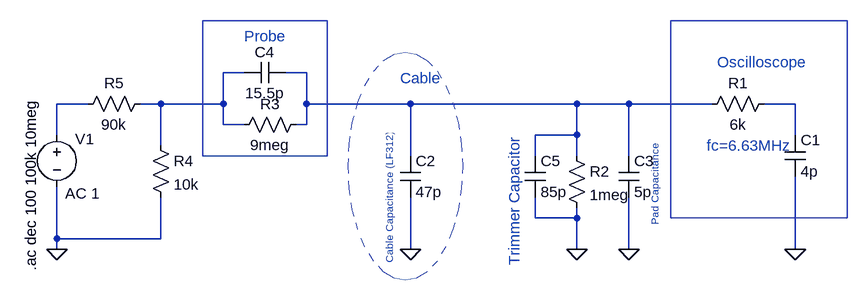
[diagram p0: schematic ADC_passiveInput_10-1.asc]
ADC_passiveInput_10-1.asc, the LTspice schematic file:
Version 4
SHEET 1 880 680
WIRE -320 32 -352 32
WIRE -224 32 -256 32
WIRE -560 80 -608 80
WIRE -448 80 -480 80
WIRE -352 80 -352 32
WIRE -352 80 -448 80
WIRE -224 80 -224 32
WIRE -64 80 -224 80
WIRE 192 80 -64 80
WIRE 272 80 192 80
WIRE 400 80 272 80
WIRE 528 80 480 80
WIRE -352 112 -352 80
WIRE -320 112 -352 112
WIRE -224 112 -224 80
WIRE -224 112 -240 112
WIRE -608 128 -608 80
WIRE 192 128 192 80
WIRE 192 128 128 128
WIRE 528 128 528 80
WIRE -448 144 -448 80
WIRE -64 160 -64 80
WIRE 128 160 128 128
WIRE 192 160 192 128
WIRE 272 160 272 80
WIRE 128 256 128 224
WIRE 192 256 192 240
WIRE 192 256 128 256
WIRE -608 288 -608 208
WIRE -448 288 -448 224
WIRE -448 288 -608 288
WIRE -608 304 -608 288
WIRE -64 304 -64 224
WIRE 192 304 192 256
WIRE 272 304 272 224
WIRE 528 304 528 192
FLAG -608 304 0
FLAG 528 304 0
FLAG 272 304 0
FLAG -64 304 0
FLAG 192 304 0
SYMBOL voltage -608 112 R0
WINDOW 0 28 22 Left 2
WINDOW 123 13 106 Left 2
WINDOW 39 0 0 Left 2
SYMATTR InstName V1
SYMATTR Value ""
SYMATTR Value2 AC 1
SYMBOL cap 512 128 R0
SYMATTR InstName C1
SYMATTR Value 4p
SYMBOL res 384 96 R270
WINDOW 0 32 56 VTop 2
WINDOW 3 0 56 VBottom 2
SYMATTR InstName R1
SYMATTR Value 6k
SYMBOL cap -80 160 R0
SYMATTR InstName C2
SYMATTR Value 47p
SYMBOL cap 256 160 R0
SYMATTR InstName C3
SYMATTR Value 5p
SYMBOL res 176 144 R0
SYMATTR InstName R2
SYMATTR Value 1meg
SYMBOL res -464 128 R0
SYMATTR InstName R4
SYMATTR Value 10k
SYMBOL res -336 128 R270
WINDOW 0 32 56 VTop 2
WINDOW 3 0 56 VBottom 2
SYMATTR InstName R3
SYMATTR Value 9meg
SYMBOL cap -320 48 R270
WINDOW 0 32 32 VTop 2
WINDOW 3 0 32 VBottom 2
SYMATTR InstName C4
SYMATTR Value 15.5p
SYMBOL res -576 96 R270
WINDOW 0 32 56 VTop 2
WINDOW 3 0 56 VBottom 2
SYMATTR InstName R5
SYMATTR Value 90k
SYMBOL cap 112 160 R0
SYMATTR InstName C5
SYMATTR Value 85p
TEXT -648 72 VRight 2 !.ac dec 100 100k 10meg
TEXT 408 16 Left 2 ;Oscilloscope
TEXT -96 128 VRight 1 ;Cable Capacitance (LF312)
TEXT 312 144 VRight 1 ;Pad Capacitance
TEXT 392 144 Left 2 ;fc=6.63MHz
TEXT -320 -24 Left 2 ;Probe
TEXT -80 40 Left 2 ;Cable
TEXT 96 128 VRight 2 ;Trimmer Capacitor
RECTANGLE Normal 608 256 336 -48
RECTANGLE Normal -192 160 -384 -48
CIRCLE Normal 16 352 -160 0 2

The netlist it stands for:
* ADC_passiveInput_10-1.asc
V1 N003 0 AC 1
C1 N004 0 4p
R1 N002 N004 6k
C2 N002 0 47p
C3 N002 0 5p
R2 N002 0 1meg
R4 N001 0 10k
R3 N001 N002 9meg
C4 N001 N002 15.5p
R5 N003 N001 90k
C5 N002 0 85p
.ac dec 100 100k 10meg
* Oscilloscope
* Cable Capacitance (LF312)
* Pad Capacitance
* fc=6.63MHz
* Probe
* Cable
* Trimmer Capacitor
.backanno
.end